# Altium schematic sheet config.SchDoc: CS - Config Options
size Letter; CheckedBy: J. Brinton; CompanyName: Signal Laboratories, Inc.; DrawnBy: J. Brinton; Engineer: J. Brinton; Address1: 3479 Edison Way; Address2: Menlo Park CA 94025; Address3: +1 (877) 778-8435; Address4: siglabs.com; Revision: 3; SheetNumber: 22; SheetTotal: 47
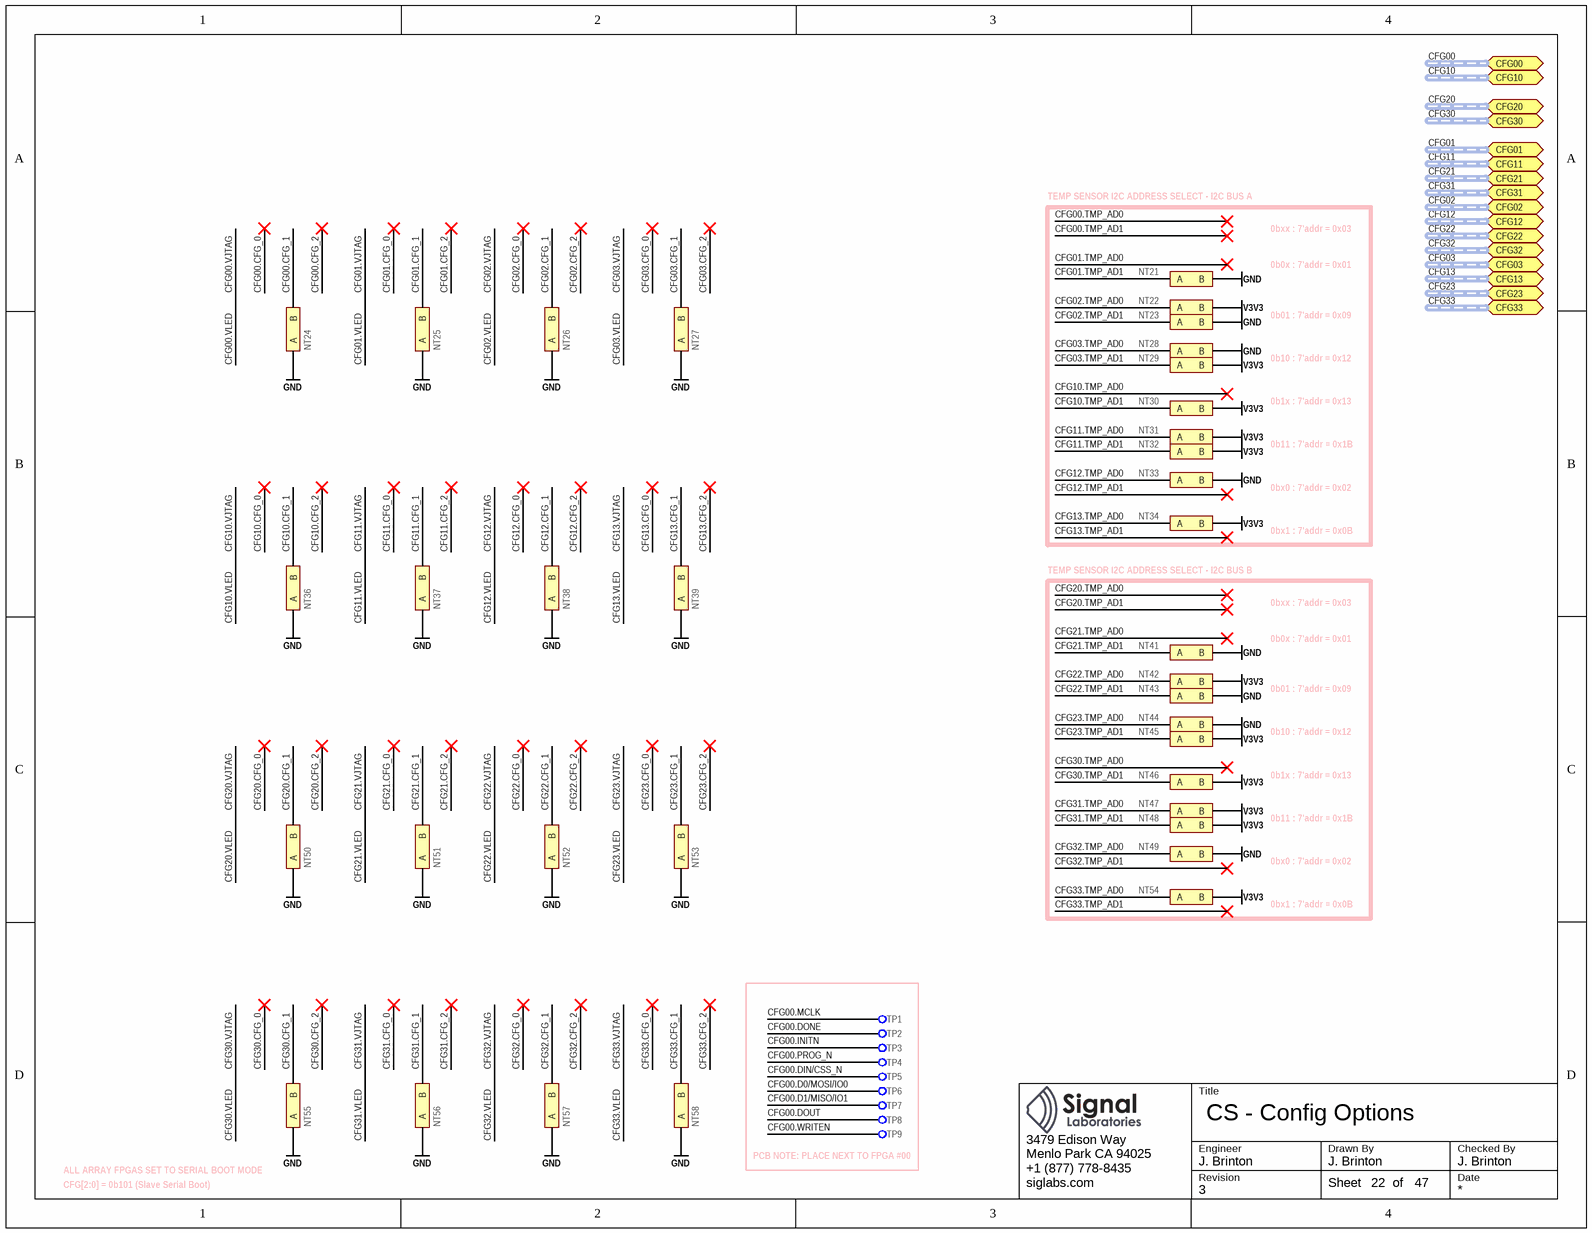
[diagram p0: config.SchDoc]

## Parts
NT21  NET_TIE  [NET_TIE]  (value not drawn)  (net tie, no BOM)
NT22  NET_TIE  [NET_TIE]  (value not drawn)  (net tie, no BOM)
NT23  NET_TIE  [NET_TIE]  (value not drawn)  (net tie, no BOM)
NT24  NET_TIE  [NET_TIE_400]  (value not drawn)  (net tie, no BOM)
NT25  NET_TIE  [NET_TIE_400]  (value not drawn)  (net tie, no BOM)
NT26  NET_TIE  [NET_TIE_400]  (value not drawn)  (net tie, no BOM)
NT27  NET_TIE  [NET_TIE_400]  (value not drawn)  (net tie, no BOM)
NT28  NET_TIE  [NET_TIE]  (value not drawn)  (net tie, no BOM)
NT29  NET_TIE  [NET_TIE]  (value not drawn)  (net tie, no BOM)
NT30  NET_TIE  [NET_TIE]  (value not drawn)  (net tie, no BOM)
NT31  NET_TIE  [NET_TIE]  (value not drawn)  (net tie, no BOM)
NT32  NET_TIE  [NET_TIE]  (value not drawn)  (net tie, no BOM)
NT33  NET_TIE  [NET_TIE]  (value not drawn)  (net tie, no BOM)
NT34  NET_TIE  [NET_TIE]  (value not drawn)  (net tie, no BOM)
NT36  NET_TIE  [NET_TIE_400]  (value not drawn)  (net tie, no BOM)
NT37  NET_TIE  [NET_TIE_400]  (value not drawn)  (net tie, no BOM)
NT38  NET_TIE  [NET_TIE_400]  (value not drawn)  (net tie, no BOM)
NT39  NET_TIE  [NET_TIE_400]  (value not drawn)  (net tie, no BOM)
NT41  NET_TIE  [NET_TIE]  (value not drawn)  (net tie, no BOM)
NT42  NET_TIE  [NET_TIE]  (value not drawn)  (net tie, no BOM)
NT43  NET_TIE  [NET_TIE]  (value not drawn)  (net tie, no BOM)
NT44  NET_TIE  [NET_TIE]  (value not drawn)  (net tie, no BOM)
NT45  NET_TIE  [NET_TIE]  (value not drawn)  (net tie, no BOM)
NT46  NET_TIE  [NET_TIE]  (value not drawn)  (net tie, no BOM)
NT47  NET_TIE  [NET_TIE]  (value not drawn)  (net tie, no BOM)
NT48  NET_TIE  [NET_TIE]  (value not drawn)  (net tie, no BOM)
NT49  NET_TIE  [NET_TIE]  (value not drawn)  (net tie, no BOM)
NT50  NET_TIE  [NET_TIE_400]  (value not drawn)  (net tie, no BOM)
NT51  NET_TIE  [NET_TIE_400]  (value not drawn)  (net tie, no BOM)
NT52  NET_TIE  [NET_TIE_400]  (value not drawn)  (net tie, no BOM)
NT53  NET_TIE  [NET_TIE_400]  (value not drawn)  (net tie, no BOM)
NT54  NET_TIE  [NET_TIE]  (value not drawn)  (net tie, no BOM)
NT55  NET_TIE  [NET_TIE_400]  (value not drawn)  (net tie, no BOM)
NT56  NET_TIE  [NET_TIE_400]  (value not drawn)  (net tie, no BOM)
NT57  NET_TIE  [NET_TIE_400]  (value not drawn)  (net tie, no BOM)
NT58  NET_TIE  [NET_TIE_400]  (value not drawn)  (net tie, no BOM)
TP1  5000  [TEST_POINT_SMD_10]  (value not drawn)  (no BOM)
TP2  5000  [TEST_POINT_SMD_10]  (value not drawn)  (no BOM)
TP3  5000  [TEST_POINT_SMD_10]  (value not drawn)  (no BOM)
TP4  5000  [TEST_POINT_SMD_10]  (value not drawn)  (no BOM)
TP5  5000  [TEST_POINT_SMD_10]  (value not drawn)  (no BOM)
TP6  5000  [TEST_POINT_SMD_10]  (value not drawn)  (no BOM)
TP7  5000  [TEST_POINT_SMD_10]  (value not drawn)  (no BOM)
TP8  5000  [TEST_POINT_SMD_10]  (value not drawn)  (no BOM)
TP9  5000  [TEST_POINT_SMD_10]  (value not drawn)  (no BOM)

## Blocks framed on the sheet
PCB NOTE: PLACE NEXT TO FPGA #00: TP1-TP9

## Ports
CFG00 (harness CFG), CFG01 (harness CFG), CFG02 (harness CFG), CFG03 (harness CFG), CFG10 (harness CFG), CFG11 (harness CFG), CFG12 (harness CFG), CFG13 (harness CFG), CFG20 (harness CFG), CFG21 (harness CFG), CFG22 (harness CFG), CFG23 (harness CFG), CFG30 (harness CFG), CFG31 (harness CFG), CFG32 (harness CFG), CFG33 (harness CFG)

## Nets
GND: NT21.B NT23.B NT24.A NT25.A NT26.A NT27.A NT28.B NT33.B NT36.A NT37.A NT38.A NT39.A NT41.B NT43.B NT44.B NT49.B NT50.A NT51.A NT52.A NT53.A NT55.A NT56.A NT57.A NT58.A
V3V3: NT22.B NT29.B NT30.B NT31.B NT32.B NT34.B NT42.B NT45.B NT46.B NT47.B NT48.B NT54.B
CFG00.CFG_1: NT24.B
CFG00.D0/MOSI/IO0: TP6.1
CFG00.D1/MISO/IO1: TP7.1
CFG00.DIN/CSS_N: TP5.1
CFG00.DONE: TP2.1
CFG00.DOUT: TP8.1
CFG00.INITN: TP3.1
CFG00.MCLK: TP1.1
CFG00.PROG_N: TP4.1
CFG00.WRITEN: TP9.1
CFG01.CFG_1: NT25.B
CFG01.TMP_AD1: NT21.A
CFG02.CFG_1: NT26.B
CFG02.TMP_AD0: NT22.A
CFG02.TMP_AD1: NT23.A
CFG03.CFG_1: NT27.B
CFG03.TMP_AD0: NT28.A
CFG03.TMP_AD1: NT29.A
CFG10.CFG_1: NT36.B
CFG10.TMP_AD1: NT30.A
CFG11.CFG_1: NT37.B
CFG11.TMP_AD0: NT31.A
CFG11.TMP_AD1: NT32.A
CFG12.CFG_1: NT38.B
CFG12.TMP_AD0: NT33.A
CFG13.CFG_1: NT39.B
CFG13.TMP_AD0: NT34.A
CFG20.CFG_1: NT50.B
CFG21.CFG_1: NT51.B
CFG21.TMP_AD1: NT41.A
CFG22.CFG_1: NT52.B
CFG22.TMP_AD0: NT42.A
CFG22.TMP_AD1: NT43.A
CFG23.CFG_1: NT53.B
CFG23.TMP_AD0: NT44.A
CFG23.TMP_AD1: NT45.A
CFG30.CFG_1: NT55.B
CFG30.TMP_AD1: NT46.A
CFG31.CFG_1: NT56.B
CFG31.TMP_AD0: NT47.A
CFG31.TMP_AD1: NT48.A
CFG32.CFG_1: NT57.B
CFG32.TMP_AD0: NT49.A
CFG33.CFG_1: NT58.B
CFG33.TMP_AD0: NT54.A

## Buses and harness runs
harness CFG00 = port CFG00
harness CFG01 = port CFG01
harness CFG02 = port CFG02
harness CFG03 = port CFG03
harness CFG10 = port CFG10
harness CFG11 = port CFG11
harness CFG12 = port CFG12
harness CFG13 = port CFG13
harness CFG20 = port CFG20
harness CFG21 = port CFG21
harness CFG22 = port CFG22
harness CFG23 = port CFG23
harness CFG30 = port CFG30
harness CFG31 = port CFG31
harness CFG32 = port CFG32
harness CFG33 = port CFG33

## Notes on the sheet
- TEMP SENSOR I2C ADDRESS SELECT - I2C BUS A
- 0bxx : 7'addr = 0x03
- 0b0x : 7'addr = 0x01
- 0b01 : 7'addr = 0x09
- 0b10 : 7'addr = 0x12
- 0b1x : 7'addr = 0x13
- 0b11 : 7'addr = 0x1B
- 0bx0 : 7'addr = 0x02
- 0bx1 : 7'addr = 0x0B
- (near NT34) TEMP SENSOR I2C ADDRESS SELECT - I2C BUS B
- (near NT55) ALL ARRAY FPGAS SET TO SERIAL BOOT MODE
- CFG[2:0] = 0b101 (Slave Serial Boot)
- Title
- Engineer
- Revision
- Drawn By
- Checked By
- Date
- Sheet
- of

## Library data of the parts
TP1-TP9 = TEST_POINT: Thruhole Miniature Test Point; Manufacturer: Keystone Electronics Corp; Manufacturer P/N: 5000; Do Not Place: *